# Altium schematic sheet NRF24L01.SchDoc
size A4; SheetNumber: 2; SheetTotal: 3
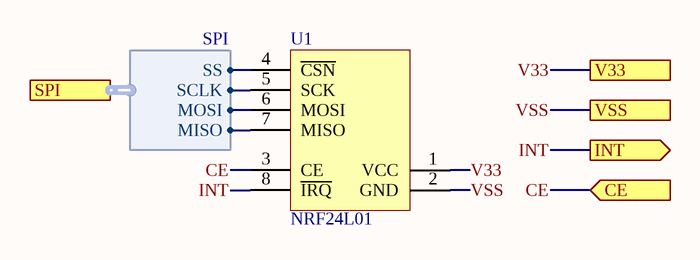
[diagram p0: NRF24L01.SchDoc]

## Parts
U1  NRF24L01  [NRF24L01P+PA+LNA+IPX]

## Ports
CE (in), INT (out), SPI (harness SPI), V33, VSS

## Harnesses
SPI: SS, SCLK, MOSI, MISO

## Nets
CE: U1.3(CE) ; port CE
INT: U1.8(~{IRQ}) ; port INT
V33: U1.1(VCC) ; port V33
VSS: U1.2(GND) ; port VSS
NetU1_4: U1.4(~{CSN}) ; port SPI.SS
NetU1_5: U1.5(SCK) ; port SPI.SCLK
NetU1_6: U1.6(MOSI) ; port SPI.MOSI
NetU1_7: U1.7(MISO) ; port SPI.MISO

## Library data of the parts
U1 = NRF24L01_module: pin to pad: 2>8 3>2 4>3 5>4 6>5 7>6 8>7